# Altium schematic sheet Switch2 copy.SchDoc
size 299 x 308 mm
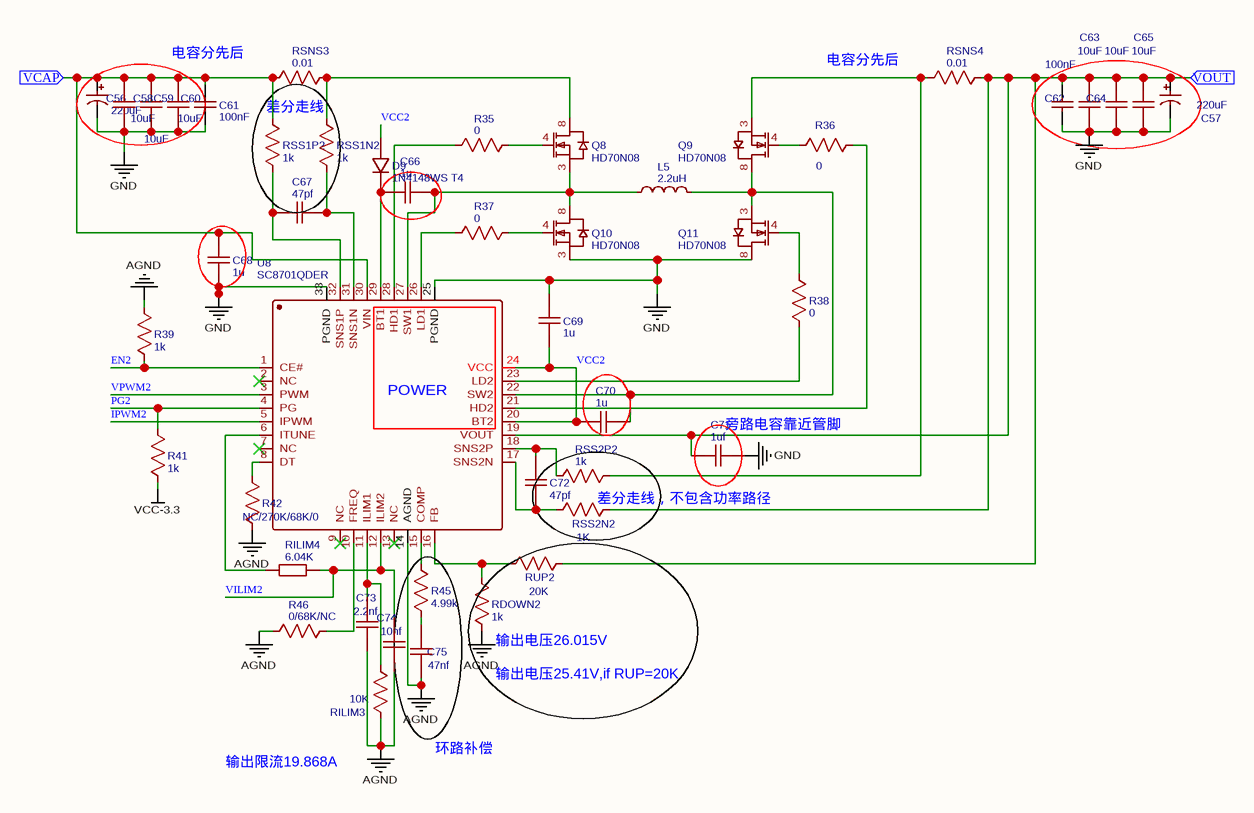
[diagram p0: Switch2 copy.SchDoc]

## Parts
C56  220uF  [CAP-SMD_BD10.0-L10.3-W10.3-FD]
C57  220uF  [CAP-SMD_BD10.0-L10.3-W10.3-FD]
C58  10uF  [C1206]
C59  10uF  [C1206]
C60  10uF  [C1206]
C61  100nF  [C0603]
C62  100nF  [C0603]
C63  10uF  [C1206]
C64  10uF  [C1206]
C65  10uF  [C1206]
C66  1u  [C0402]
C67  47pf  [C0402]
C68  1u  [C0402]
C69  1u  [C0402]
C70  1u  [C0402]
C71  1uf  [C0402]
C72  47pf  [C0402]
C73  2.2nf  [C0402]
C74  10nf  [C0402]
C75  47nf  [C0402]
D9  1N4148WS T4  [SOD-323_L1.8-W1.3-LS2.5-FD]
L5  2.2uH  [IND-SMD_L17.5-W17.0_YXMAC1770]
Q8  HD70N08  [PDFN-8_L4.9-W5.8-P1.27-LS6.1-BL FOR3]
Q9  HD70N08  [PDFN-8_L4.9-W5.8-P1.27-LS6.1-BL FOR3]
Q10  HD70N08  [PDFN-8_L4.9-W5.8-P1.27-LS6.1-BL FOR3]
Q11  HD70N08  [PDFN-8_L4.9-W5.8-P1.27-LS6.1-BL FOR3]
R35  0  [R0603]
R36  0  [R0603]
R37  0  [R0603]
R38  0  [R0603]
R39  1k  [R0402]
R41  1k  [R0402]
R42  NC/270K/68K/0  [R0402]
R45  4.99k  [R0402]
R46  0/68K/NC  [R0402]
RDOWN2  1k  [R0402]
RILIM3  10K  [R0402]
RILIM4  6.04K  [R0402]
RSNS3  0.01  [R0805]
RSNS4  0.01  [R0805]
RSS1N2  1k  [R0402]
RSS1P2  1k  [R0402]
RSS2N2  1K  [R0402]
RSS2P2  1k  [R0402]
RUP2  20K  [R0402]
U8  SC8701QDER  [QFN-32_L4.0-W4.0-P0.4-BL-EP2.6]

## Blocks framed on the sheet
POWER: U8

## Ports
VCAP (in), VOUT (in)

## Nets
AGND: C73.1 C74.1 C75.1 R39.2 R42.1 R46.1 RDOWN2.1 RILIM3.1 U8.14(AGND)
GND: C56.2 C57.2 C58.1 C59.1 C60.1 C61.1 C62.1 C63.1 C64.1 C65.1 C68.1 C69.2 C71.1 Q10.3(S) Q11.8(D) U8.25(PGND) U8.33(PGND)
VCC-3.3: R41.1
EN2: R39.1 U8.1(CE#)
IPWM2: U8.5(IPWM)
PG2: R41.2 U8.4(PG)
VCAP: C56.1 C58.2 C59.2 C60.2 C61.2 C68.2 RSNS3.1 RSS1P2.2 U8.30(VIN) ; port VCAP
VCC2: C69.1 C70.2 D9.1(A) U8.20(BT2) U8.24(VCC)
VILIM2: C74.2 RILIM4.2 U8.12(ILIM2)
VOUT: C57.1 C62.2 C63.2 C64.2 C65.2 C71.2 RSNS4.2 RSS2N2.2 RUP2.2 U8.19(VOUT) ; port VOUT
VPWM2: U8.3(PWM)
NetC66_1: C66.1 D9.2(K) U8.29(BT1)
NetC66_2: C66.2 L5.1 Q8.3(S) Q10.8(D) U8.27(SW1)
NetC67_1: C67.1 RSS1N2.1 U8.31(SNS1N)
NetC67_2: C67.2 RSS1P2.1 U8.32(SNS1P)
NetC70_1: C70.1 L5.2 Q9.8(D) Q11.3(S) U8.22(SW2)
NetC72_1: C72.1 RSS2P2.1 U8.18(SNS2P)
NetC72_2: C72.2 RSS2N2.1 U8.17(SNS2N)
NetC73_2: C73.2 RILIM3.2 U8.11(ILIM1)
NetC75_2: C75.2 R45.1
NetQ8_4: Q8.4(G) R35.2
NetQ8_8: Q8.8(D) RSNS3.2 RSS1N2.2
NetQ9_3: Q9.3(S) RSNS4.1 RSS2P2.2
NetQ9_4: Q9.4(G) R36.1
NetQ10_4: Q10.4(G) R37.2
NetQ11_4: Q11.4(G) R38.2
NetR35_1: R35.1 U8.28(HD1)
NetR36_2: R36.2 U8.21(HD2)
NetR37_1: R37.1 U8.26(LD1)
NetR38_1: R38.1 U8.23(LD2)
NetR42_2: R42.2 U8.8(DT)
NetR45_2: R45.2 U8.15(COMP)
NetR46_2: R46.2 U8.10(FREQ)
NetRDOWN2_2: RDOWN2.2 RUP2.1 U8.16(FB)
NetRILIM4_1: RILIM4.1 U8.6(ITUNE)

Not connected (* = marked no-connect by the designer): U8 2(NC)* 7(NC)* 9(NC)* 13(NC)*

## Notes on the sheet
- 电容分先后
- (near RSS1P2) 差分走线
- (near C63) C64
- (near C71) 旁路电容靠近管脚
- (near RSS2N2) 差分走线，不包含功率路径
- (near RDOWN2) 输出电压26.015V
- (near RDOWN2) 输出电压25.41V,if RUP=20K
- 输出限流19.868A
- 环路补偿

## Library data of the parts
C56 C57 = 220uF: BOM_Manufacturer: CapXon; BOM_Manufacturer Part: DV221M050G105A; nameAlias: Capacitance; BOM_Supplier: LCSC; BOM_Supplier Part: C65217; spicePre: C; spiceSymbolName: DV221M050G105A
C58-C60 C63-C65 = 10uF: BOM_Manufacturer: MuRata; BOM_Manufacturer Part: GRM31CR61H106KA12L; nameAlias: Capacitance; BOM_Supplier: LCSC; BOM_Supplier Part: C77092; spicePre: C; spiceSymbolName: GRM31CR61H106KA12L
C61 C62 = 100nF: BOM_Manufacturer Part: CL10B104JB8NNNC; BOM_Manufacturer: SAMSUNG; nameAlias: Capacitance; SMT Type: Extend; BOM_Supplier: LCSC; BOM_Supplier Part: C1525; BOM_LCSC Assembly: Yes; spicePre: C; spiceSymbolName: CL10B104JB8NNNC
C66 C68-C70 = 1u: nameAlias: Value(F); spicePre: C; spiceSymbolName: Cap_0402_US
C67 C72 = 47pf: nameAlias: Value(F); spicePre: C; spiceSymbolName: Cap_0402_US
C71 = 1uf: nameAlias: Value(F); spicePre: C; spiceSymbolName: Cap_0402_US
C73 = 2.2nf: nameAlias: Value(F); spicePre: C; spiceSymbolName: Cap_0402_US
C74 = 10nf: nameAlias: Value(F); spicePre: C; spiceSymbolName: Cap_0402_US
C75 = 47nf: nameAlias: Value(F); spicePre: C; spiceSymbolName: Cap_0402_US
D9 = 1N4148WS T4: BOM_Manufacturer: CJ; SMT Type: Basic; BOM_Supplier: LCSC; BOM_Manufacturer Part: 1N4148WS T4; BOM_LCSC Assembly: Yes; image: //image.lceda.cn/szlcsc/C2128.jpg; BOM_Supplier Part: C2128; spicePre: D; spiceSymbolName: 1N4148WS T4
L5 = 2.2uH: BOM_Manufacturer: YUXIN TECH; BOM_Manufacturer Part: YXMAC1770-2R2M-IGP; nameAlias: Inductance; Contributor: LCSC; BOM_Supplier: LCSC; BOM_Supplier Part: C241452; spicePre: L; spiceSymbolName: YXMAC1770-2R2M-IGP
Q8-Q11 = HD70N08: BOM_Manufacturer: HL; Contributor: LCSC; BOM_Supplier: LCSC; BOM_Supplier Part: C216254; BOM_Manufacturer Part: HD70N08; spicePre: Q; spiceSymbolName: HD70N08
R35-R38 = 0: nameAlias: Value(Ω); spicePre: R; spiceSymbolName: Res_0402(1/16W)_US
R39 R41 RDOWN2 RSS1N2 RSS1P2 RSS2P2 = 1k: nameAlias: Value(Ω); spicePre: R; spiceSymbolName: Res_0402(1/16W)_US
  RSS1N2 RSS1P2 RSS2P2: BOM_Supplier Part: C319809
R42 = NC/270K/68K/0: nameAlias: Value(Ω); spicePre: R; spiceSymbolName: Res_0402(1/16W)_US
R45 = 4.99k: nameAlias: Value(Ω); spicePre: R; spiceSymbolName: Res_0402(1/16W)_US
R46 = 0/68K/NC: nameAlias: Value(Ω); spicePre: R; spiceSymbolName: Res_0402(1/16W)_US
RILIM3 = 10K: nameAlias: Value(Ω); spicePre: R; spiceSymbolName: Res_0402(1/16W)_US
RILIM4 = 6.04K: BOM_Manufacturer: WTC; BOM_Manufacturer Part: WR04X6041FTL; nameAlias: Resistance (Ohms); Contributor: LCSC; BOM_Supplier: LCSC; BOM_Supplier Part: C168240; spicePre: R; spiceSymbolName: WR04X6041FTL
RSNS3 RSNS4 = 0.01: nameAlias: Value(Ω); spicePre: R; spiceSymbolName: Res_0402(1/16W)_US; BOM_Supplier Part: C236284
RSS2N2 = 1K: nameAlias: Value(Ω); spicePre: R; spiceSymbolName: Res_0402(1/16W)_US; BOM_Supplier Part: C319809
RUP2 = 20K: nameAlias: Value(Ω); spicePre: R; spiceSymbolName: Res_0402(1/16W)_US
U8 = SC8701QDER: BOM_Manufacturer: Southchip Semicon; Contributor: LCSC; SMT Type: Extend; BOM_Supplier: LCSC; BOM_Supplier Part: C252410; BOM_Manufacturer Part: SC8701QDER; BOM_LCSC Assembly: Yes; spicePre: U; spiceSymbolName: SC8701QDER